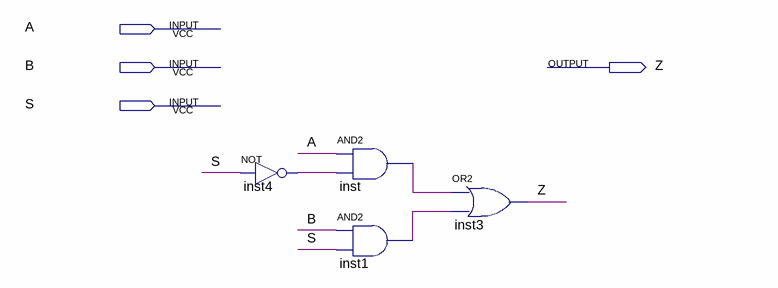
[diagram p0: schematic sheet]
// Quartus schematic MUX2_1_1bit.bdf as structural Verilog: 4 symbols, 4 pins
module MUX2_1_1bit (
  input  A,
  input  B,
  input  S,
  output Z
);

  wire inst1_out, inst4_out, inst_out;

  not inst4 (inst4_out, S);
  and inst (inst_out, A, inst4_out);
  and inst1 (inst1_out, B, S);
  or inst3 (Z, inst_out, inst1_out);
endmodule
